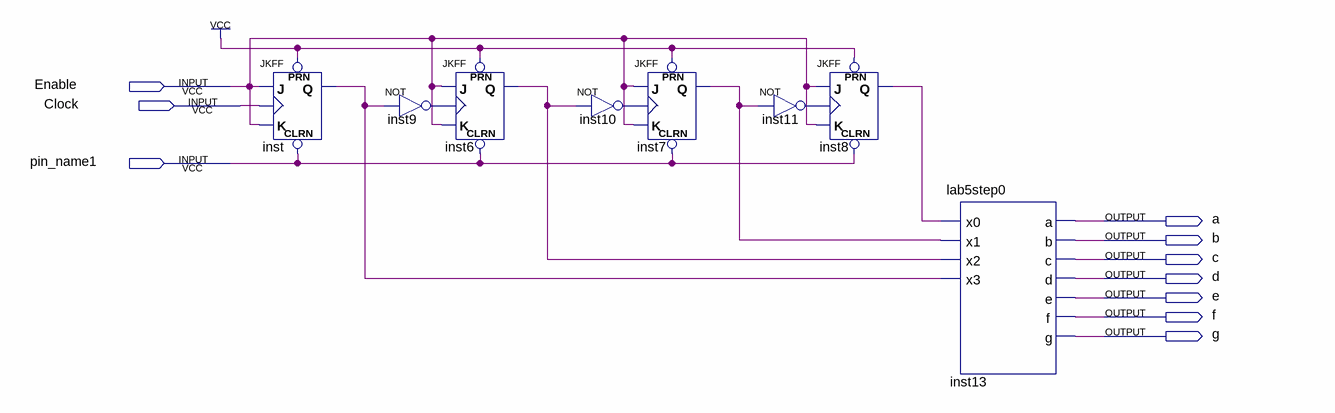
[diagram p0: schematic sheet]
// Quartus schematic lab10step3a.bdf as structural Verilog: 8 symbols, 10 pins
module lab10step3a (
  input  Enable,
  input  Clock,
  input  pin_name1,
  output a,
  output b,
  output c,
  output d,
  output e,
  output f,
  output g
);

  wire inst6_q, inst7_q, inst8_q, inst9_out, inst10_out, inst11_out, inst_q;

  JKFF inst (.PRN(1'b1), .CLRN(pin_name1), .K(Enable), .J(Enable), .CLK(Clock), .Q(inst_q));
  JKFF inst6 (.PRN(1'b1), .CLRN(pin_name1), .K(Enable), .J(Enable), .CLK(inst9_out), .Q(inst6_q));
  not inst9 (inst9_out, inst_q);
  not inst10 (inst10_out, inst6_q);
  JKFF inst7 (.PRN(1'b1), .CLRN(pin_name1), .K(Enable), .J(Enable), .CLK(inst10_out), .Q(inst7_q));
  JKFF inst8 (.PRN(1'b1), .CLRN(pin_name1), .K(Enable), .J(Enable), .CLK(inst11_out), .Q(inst8_q));
  not inst11 (inst11_out, inst7_q);
  lab5step0 inst13 (
    .x0(inst8_q), .x1(inst7_q), .x2(inst6_q), .x3(inst_q), .a(a), .b(b), .c(c), .d(d), .e(e), .f(f), .g(g));
endmodule
